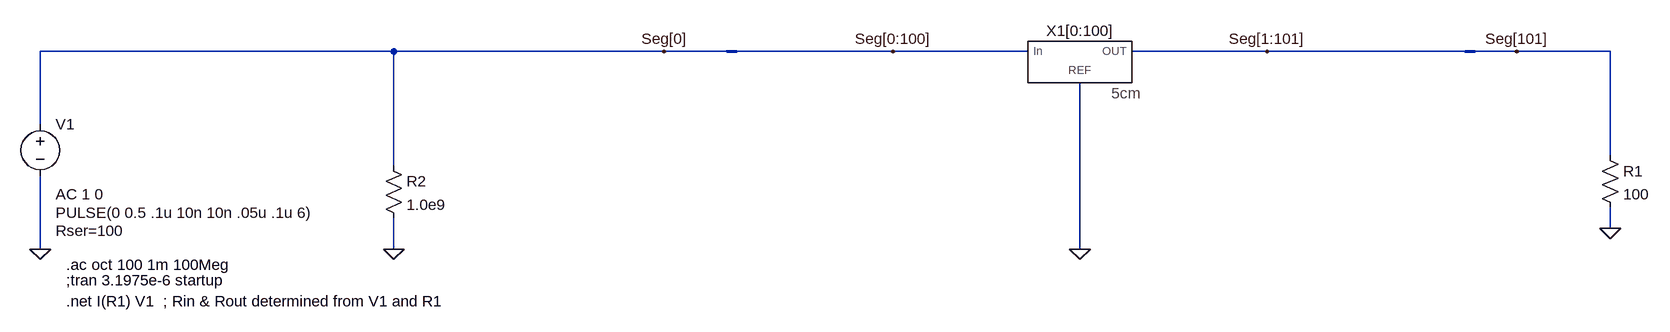
[diagram p0: schematic Cable Model Check.asc]
Cable Model Check.asc, the LTspice schematic file:
Version 4
SHEET 1 2100 1012
WIRE 160 240 -384 240
WIRE 576 240 160 240
WIRE 672 240 576 240
WIRE 928 240 688 240
WIRE 1136 240 928 240
WIRE 1504 240 1296 240
WIRE 1808 240 1504 240
WIRE 1888 240 1824 240
WIRE 2032 240 1888 240
WIRE -384 352 -384 240
WIRE 2032 400 2032 240
WIRE 160 416 160 240
WIRE 2032 512 2032 480
WIRE -384 544 -384 432
WIRE 160 544 160 496
WIRE 1216 544 1216 288
FLAG -384 544 0
FLAG 2032 512 0
FLAG 1216 544 0
FLAG 160 544 0
FLAG 576 240 Seg[0]
FLAG 1888 240 Seg[101]
FLAG 928 240 Seg[0:100]
FLAG 1504 240 Seg[1:101]
BUSTAP 1808 240 1824 240
BUSTAP 672 240 688 240
SYMBOL res 2016 384 R0
SYMATTR InstName R1
SYMATTR Value 100
SYMBOL voltage -384 336 R0
WINDOW 3 24 152 Left 2
WINDOW 123 24 124 Left 2
WINDOW 39 24 180 Left 2
SYMATTR InstName V1
SYMATTR Value PULSE(0 0.5 .1u 10n 10n .05u .1u 6)
SYMATTR Value2 AC 1 0
SYMATTR SpiceLine Rser=100
SYMBOL PanduitCable18AWG 1216 240 R0
SYMATTR InstName X1[0:100]
SYMBOL res 144 400 R0
SYMATTR InstName R2
SYMATTR Value 1.0e9
TEXT -344 592 Left 2 !;tran 3.1975e-6 startup
TEXT -344 568 Left 2 !.ac oct 100 1m 100Meg
TEXT -344 624 Left 2 !.net I(R1) V1  ; Rin & Rout determined from V1 and R1

The netlist it stands for:
* Cable Model Check.asc
R1 Seg[101] 0 100
V1 Seg[0] 0 PULSE(0 0.5 .1u 10n 10n .05u .1u 6) AC 1 0 Rser=100
XX1[0:100] Seg[0:100] Seg[1:101] 0 PanduitCable18AWG  ; pins In OUT REF
R2 Seg[0] 0 1.0e9
;tran 3.1975e-6 startup
.ac oct 100 1m 100Meg
.net I(R1) V1  ; Rin & Rout determined from V1 and R1
.backanno
.end